# Altium project Controller_TRK_hv2.PrjPcb
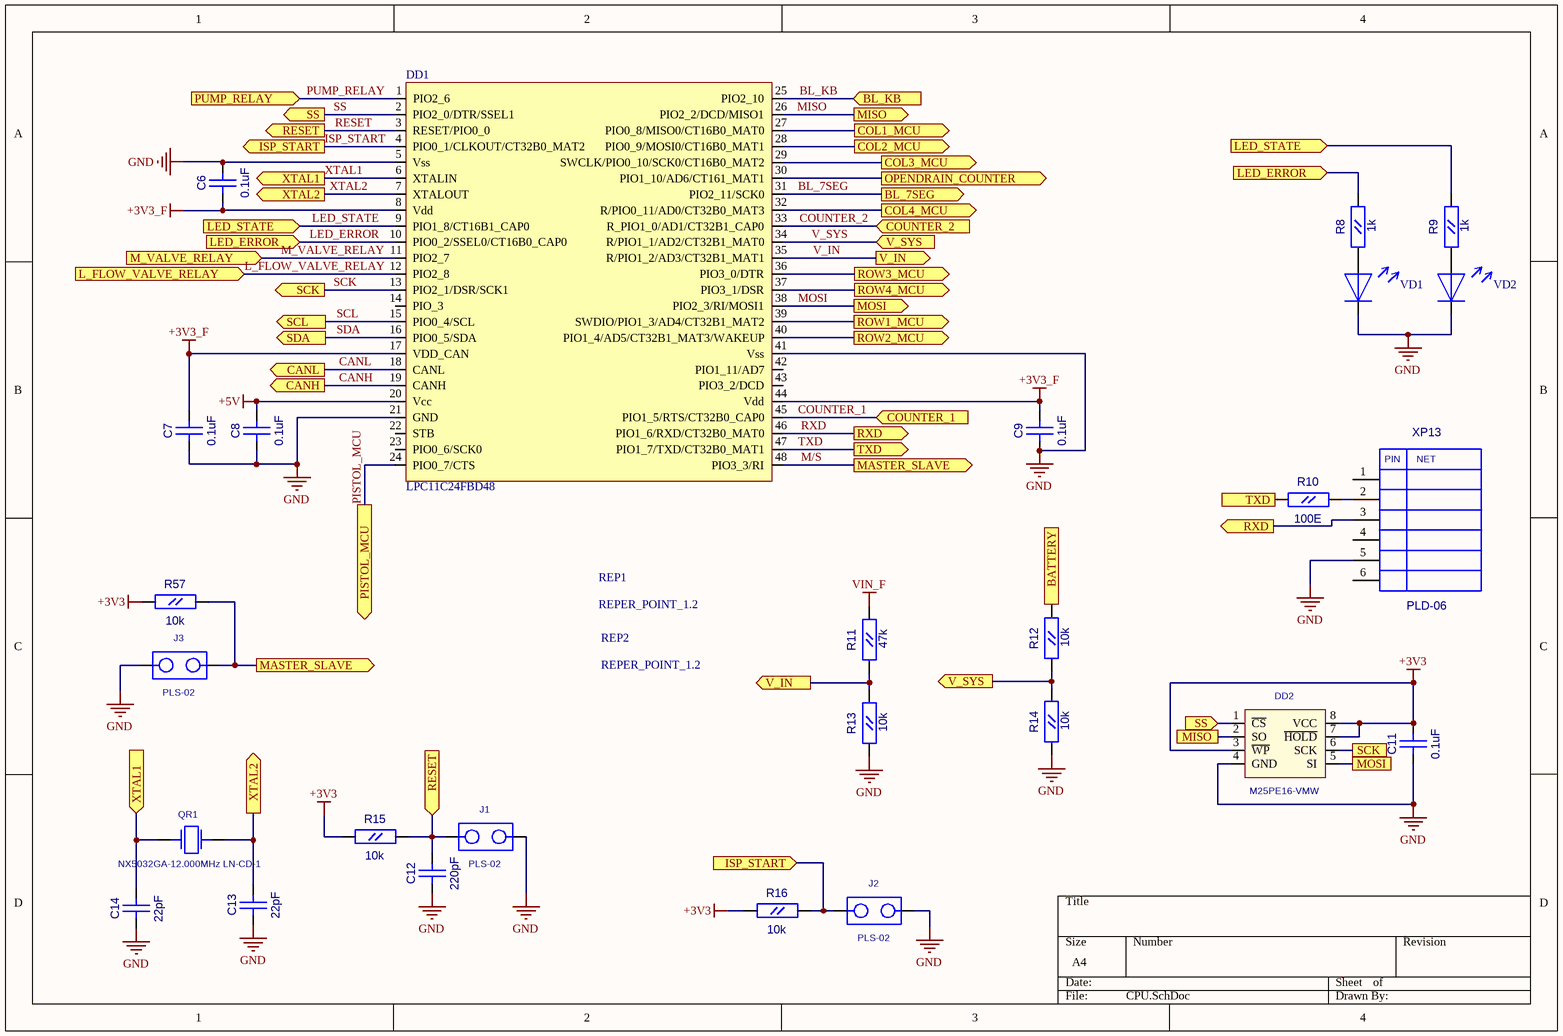
[diagram p0: CPU.SchDoc]
8 sheets, 179 parts. Net scope: flat (ports and power ports of the same name join across sheets).
Board file: Controller_TRK_hv2.PcbDoc
Sheets:
  CPU.SchDoc
  Keyboard.SchDoc
  Connections.SchDoc
  Relay.SchDoc
  Input.SchDoc
  Output.SchDoc
  Battery.SchDoc
  Power.SchDoc

## Sheet CPU.SchDoc
size A4

### Parts
C6  0.1uF  [CC0603]
C7  0.1uF  [CC0603]
C8  0.1uF  [CC0603]
C9  0.1uF  [CC0603]
C11  0.1uF  [CC0603]
C12  220pF  [CC0603]
C13  22pF  [CC0603]
C14  22pF  [CC0603]
DD1  LPC11C24FBD48  [LQFP48]
DD2  M25PE16-VMW  [EIAJ_SO8]
J1  PLS-02  [PLS-02]
J2  PLS-02  [PLS-02]
J3  PLS-02  [PLS-02]
QR1  NX5032GA-12.000MHz LN-CD-1  [AC5032_2]
R8  1k  [RC0603]
R9  1k  [RC0603]
R10  100E  [RC0603]
R11  47k  [RC0603]
R12  10k  [RC0603]
R13  10k  [RC0603]
R14  10k  [RC0603]
R15  10k  [RC0603]
R16  10k  [RC0603]
R57  10k  [RC0603]
REP1  REPER_POINT_1.2  [REPER1.2]
REP2  REPER_POINT_1.2  [REPER1.2]
VD1  LED_0805  [LED0805]  (value not drawn)
VD2  LED_0805  [LED0805]  (value not drawn)
XP13  PLD-06  [PIN6]

### Ports
BATTERY (in), BL_7SEG (out), BL_KB (in), CANH (out), CANL (out), COL1_MCU (out), COL2_MCU (out), COL3_MCU (out), COL4_MCU (out), COUNTER_1 (in), COUNTER_2 (in), ISP_START (in), ISP_START (out), L_FLOW_VALVE_RELAY (in), LED_ERROR (in), LED_STATE (in), M_VALVE_RELAY (in), MASTER_SLAVE (out), MISO, MISO (out), MOSI, MOSI (out), OPENDRAIN_COUNTER (out), PISTOL_MCU (out), PUMP_RELAY (in), RESET (in), RESET (out), ROW1_MCU (out), ROW2_MCU (out), ROW3_MCU (out), ROW4_MCU (out), RXD (out), SCK, SCK (out), SCL (out), SDA (out), SS (in), SS (out), TXD (in), TXD (out), V_IN (out), V_SYS (in), V_SYS (out), XTAL1 (in), XTAL1 (out), XTAL2 (out)

### Nets
+3V3: C11.2(B) DD2.3(~{WP}) DD2.7(~{HOLD}) DD2.8(VCC) R15.1(A) R16.1(A) R57.1(A)
+3V3_F: C6.1(A) C7.2(B) C9.2(B) DD1.8(Vdd) DD1.17(VDD_CAN) DD1.44(Vdd)
+5V: C8.2(B) DD1.20(Vcc)
GND: C6.2(B) C7.1(A) C8.1(A) C9.1(A) C11.1(A) C12.1(A) C13.1(A) C14.1(A) DD1.5(Vss) DD1.21(GND) DD1.41(Vss) DD2.4(GND) J1.2 J2.2 J3.1 R13.1(A) R14.1(A) VD1.2 VD2.2 XP13.5
VIN_F: R11.2(B)
BL_7SEG: DD1.31(PIO2_11/SCK0) ; port BL_7SEG
BL_KB: DD1.25(PIO2_10) ; port BL_KB
CANH: DD1.19(CANH) ; port CANH
CANL: DD1.18(CANL) ; port CANL
COUNTER_1: DD1.45(PIO1_5/RTS/CT32B0_CAP0) ; port COUNTER_1
COUNTER_2: DD1.33(R_PIO1_0/AD1/CT32B1_CAP0) ; port COUNTER_2
ISP_START: DD1.4(PIO0_1/CLKOUT/CT32B0_MAT2) J2.1 R16.2(B) ; port ISP_START
L_FLOW_VALVE_RELAY: DD1.12(PIO2_8) ; port L_FLOW_VALVE_RELAY
LED_ERROR: DD1.10(PIO0_2/SSEL0/CT16B0_CAP0) R8.2(B) ; port LED_ERROR
LED_STATE: DD1.9(PIO1_8/CT16B1_CAP0) R9.2(B) ; port LED_STATE
M/S: DD1.48(PIO3_3/RI) J3.2 R57.2(B) ; port MASTER_SLAVE
M_VALVE_RELAY: DD1.11(PIO2_7) ; port M_VALVE_RELAY
MISO: DD1.26(PIO2_2/DCD/MISO1) DD2.2(SO) ; port MISO
MOSI: DD1.38(PIO2_3/RI/MOSI1) DD2.5(SI) ; port MOSI
PISTOL_MCU: DD1.24(PIO0_7/CTS) ; port PISTOL_MCU
PUMP_RELAY: DD1.1(PIO2_6) ; port PUMP_RELAY
RESET: C12.2(B) DD1.3(RESET/PIO0_0) J1.1 R15.2(B) ; port RESET
RXD: DD1.46(PIO1_6/RXD/CT32B0_MAT0) XP13.3 ; port RXD
SCK: DD1.13(PIO2_1/DSR/SCK1) DD2.6(SCK) ; port SCK
SCL: DD1.15(PIO0_4/SCL) ; port SCL
SDA: DD1.16(PIO0_5/SDA) ; port SDA
SS: DD1.2(PIO2_0/DTR/SSEL1) DD2.1(~{CS}) ; port SS
TXD: DD1.47(PIO1_7/TXD/CT32B0_MAT1) R10.1(A) ; port TXD
V_IN: DD1.35(R/PIO1_2/AD3/CT32B1_MAT1) R11.1(A) R13.2(B) ; port V_IN
V_SYS: DD1.34(R/PIO1_1/AD2/CT32B1_MAT0) R12.1(A) R14.2(B) ; port V_SYS
XTAL1: C14.2(B) DD1.6(XTALIN) QR1.1 ; port XTAL1
XTAL2: C13.2(B) DD1.7(XTALOUT) QR1.2 ; port XTAL2
NetC4_2: R12.2(B) ; port BATTERY
NetDD1_27: DD1.27(PIO0_8/MISO0/CT16B0_MAT0) ; port COL1_MCU
NetDD1_28: DD1.28(PIO0_9/MOSI0/CT16B0_MAT1) ; port COL2_MCU
NetDD1_29: DD1.29(SWCLK/PIO0_10/SCK0/CT16B0_MAT2) ; port COL3_MCU
NetDD1_30: DD1.30(PIO1_10/AD6/CT161_MAT1) ; port OPENDRAIN_COUNTER
NetDD1_32: DD1.32(R/PIO0_11/AD0/CT32B0_MAT3) ; port COL4_MCU
NetDD1_36: DD1.36(PIO3_0/DTR) ; port ROW3_MCU
NetDD1_37: DD1.37(PIO3_1/DSR) ; port ROW4_MCU
NetDD1_39: DD1.39(SWDIO/PIO1_3/AD4/CT32B1_MAT2) ; port ROW1_MCU
NetDD1_40: DD1.40(PIO1_4/AD5/CT32B1_MAT3/WAKEUP) ; port ROW2_MCU
NetR8_1: R8.1(A) VD1.1
NetR9_1: R9.1(A) VD2.1
NetR10_2: R10.2(B) XP13.2

Not connected (* = marked no-connect by the designer): DD1 14(PIO_3) 22(STB) 23(PIO0_6/SCK0) 42(PIO1_11/AD7) 43(PIO3_2/DCD); REP1 1; REP2 1; XP13 1 4 6

### Notes on the sheet
- (in symbol PLD-06) PIN; NET

### Library data of the parts
C6-C9 C11-C14 = CC0603
  C6-C9 C11: Value: 0.1uF
  C12: Value: 220pF
  C13 C14: Value: 22pF
DD2 = S25FL016A0LMFI01: Value: M25PE16-VMW
QR1 = AC5032_2: AC5032/2; Value: NX5032GA-12.000MHz LN-CD-1
R8-R16 R57 = RC0603
  R8 R9: Value: 1k
  R10: Value: 100E
  R11: Value: 47k
  R12-R16 R57: Value: 10k
REP1 REP2 = REPER1.2: Value: REPER_POINT_1.2
XP13 = PLD-06: PLD06; Value: *
DD1 = LPC11C24FBD48: Value: LPC11C24FBD48
J1-J3 = PLS-02: Value: *
VD1 VD2 = LED_0805: Value: LED_0805

## Sheet Keyboard.SchDoc
size A4
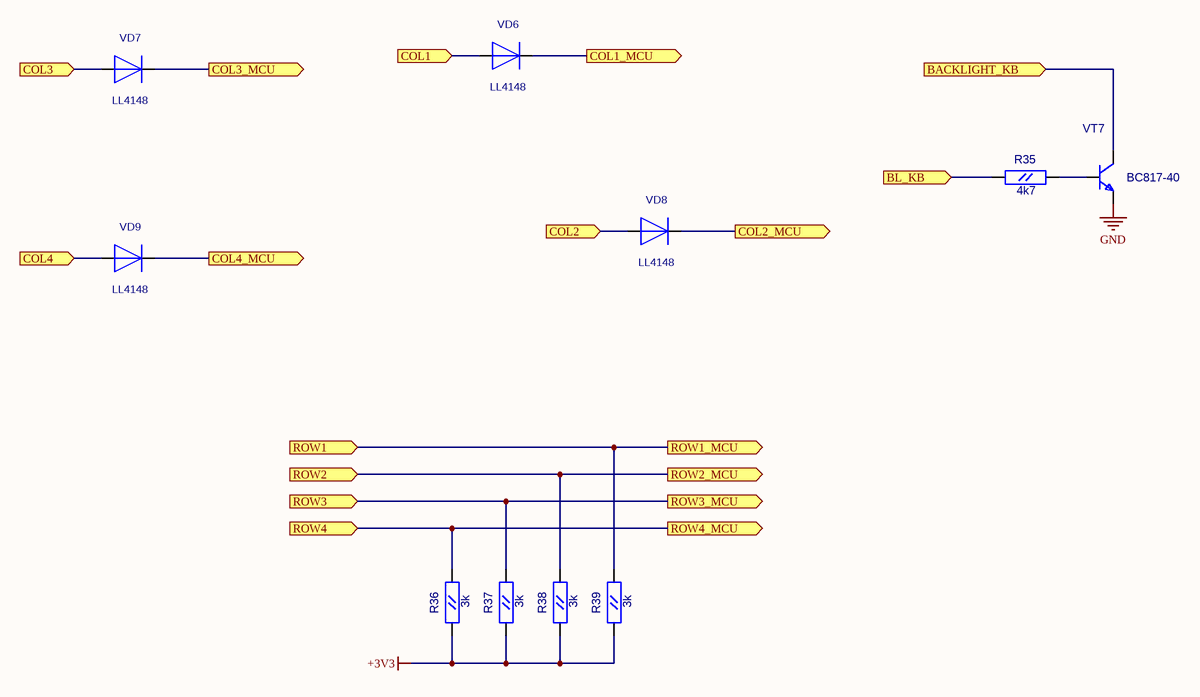
[diagram p1: Keyboard.SchDoc]

### Parts
R35  4k7  [RC0603]
R36  3k  [RC0603]
R37  3k  [RC0603]
R38  3k  [RC0603]
R39  3k  [RC0603]
VD6  LL4148  [SOD-80]
VD7  LL4148  [SOD-80]
VD8  LL4148  [SOD-80]
VD9  LL4148  [SOD-80]
VT7  BC817-40  [SOT-23(123)]

### Ports
BACKLIGHT_KB (in), BL_KB (in), COL1 (in), COL1_MCU (out), COL2 (in), COL2_MCU (out), COL3 (in), COL3_MCU (out), COL4 (in), COL4_MCU (out), ROW1 (in), ROW1_MCU (out), ROW2 (in), ROW2_MCU (out), ROW3 (in), ROW3_MCU (out), ROW4 (in), ROW4_MCU (out)

### Nets
+3V3: R36.1(A) R37.1(A) R38.1(A) R39.1(A)
GND: VT7.2(E)
BL_KB: R35.1(A) ; port BL_KB
NetDD1_27: VD6.2(+) ; port COL1_MCU
NetDD1_28: VD8.2(+) ; port COL2_MCU
NetDD1_29: VD7.2(+) ; port COL3_MCU
NetDD1_32: VD9.2(+) ; port COL4_MCU
NetDD1_36: R37.2(B) ; port ROW3_MCU, port ROW3
NetDD1_37: R36.2(B) ; port ROW4_MCU, port ROW4
NetDD1_39: R39.2(B) ; port ROW1_MCU, port ROW1
NetDD1_40: R38.2(B) ; port ROW2_MCU, port ROW2
NetR35_2: R35.2(B) VT7.1(B)
NetVD6_1: VD6.1(-) ; port COL1
NetVD7_1: VD7.1(-) ; port COL3
NetVD8_1: VD8.1(-) ; port COL2
NetVD9_1: VD9.1(-) ; port COL4
NetVT7_3: VT7.3(C) ; port BACKLIGHT_KB

### Library data of the parts
R35-R39 = RC0603
  R35: Value: 4k7
  R36-R39: Value: 3k
VT7 = BC846BLT1: NPN 500ma transistor; ComponentField7: Published 29-Sep-2000; OriginalName: BC846BLT1; Value: BC817-40
VD6-VD9 = LL4148: Value: *

## Sheet Connections.SchDoc
size A4
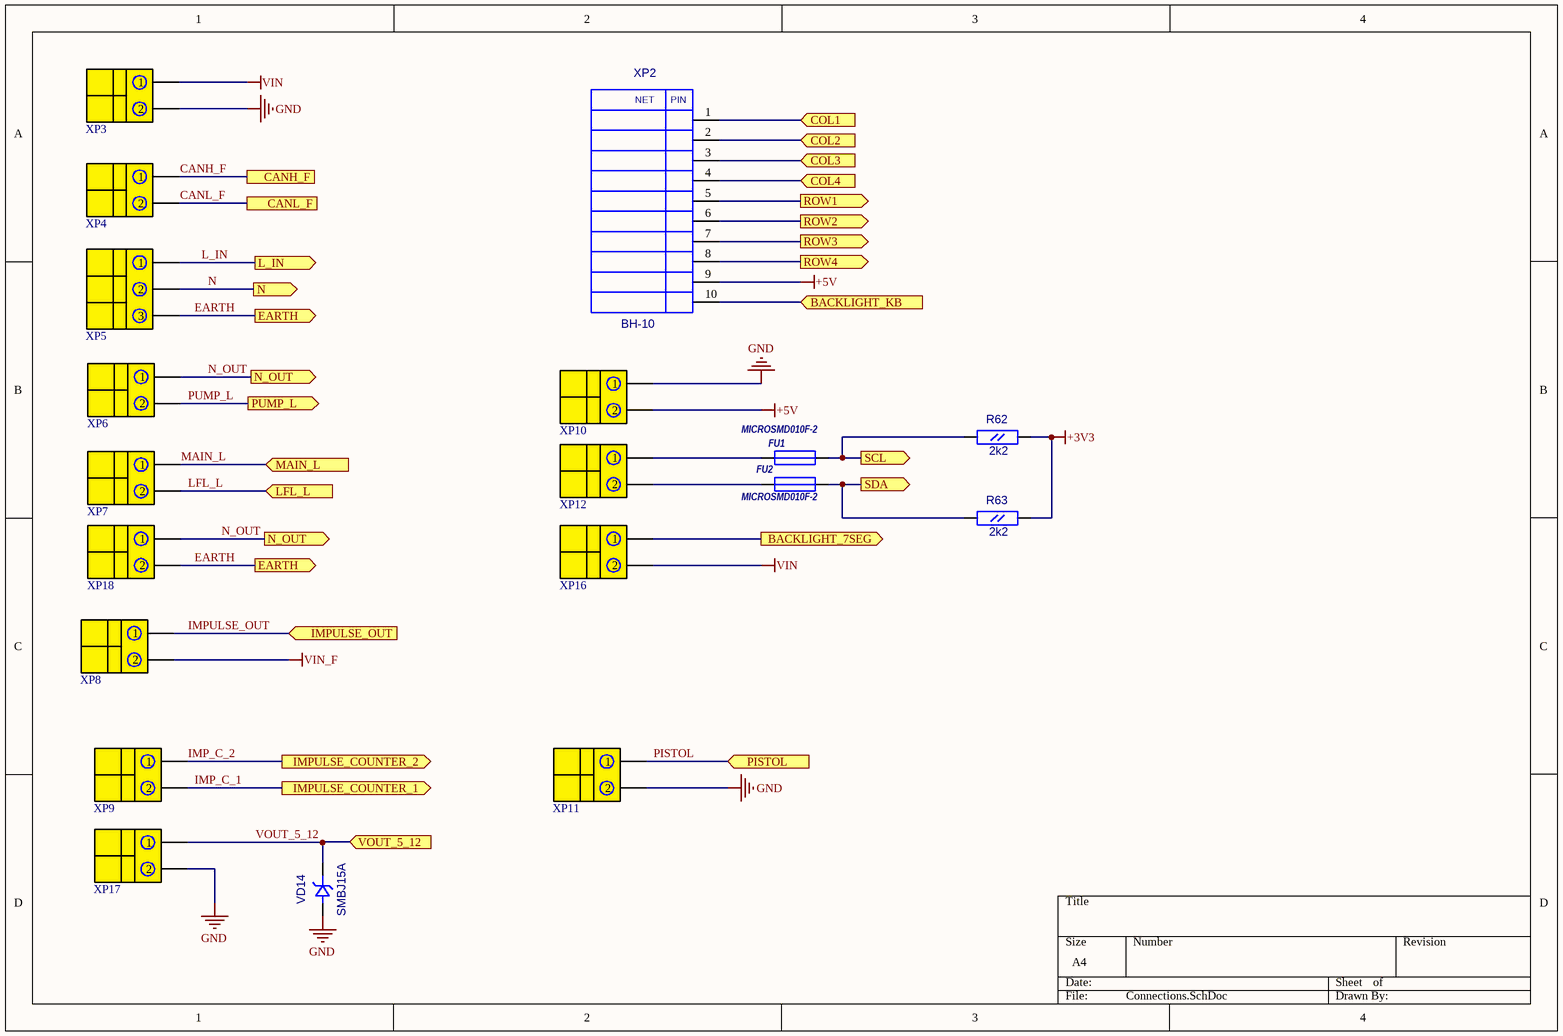
[diagram p2: Connections.SchDoc]

### Parts
FU1  MICROSMD010F-2  [RC1210]
FU2  MICROSMD010F-2  [RC1210]
R62  2k2  [RC0603]
R63  2k2  [RC0603]
VD14  SMBJ15A  [SMB]
XP2  BH-10  [BH-10]
XP3  DG330-2PIN  [DG330-2PIN]  (value not drawn)
XP4  DG330-2PIN  [DG330-2PIN]  (value not drawn)
XP5  DG330-3PIN  [DG330-3PIN]  (value not drawn)
XP6  DG330-2PIN  [DG330-2PIN]  (value not drawn)
XP7  DG330-2PIN  [DG330-2PIN]  (value not drawn)
XP8  DG330-2PIN  [DG330-2PIN]  (value not drawn)
XP9  DG330-2PIN  [DG330-2PIN]  (value not drawn)
XP10  DG330-2PIN  [DG330-2PIN]  (value not drawn)
XP11  DG330-2PIN  [DG330-2PIN]  (value not drawn)
XP12  DG330-2PIN  [DG330-2PIN]  (value not drawn)
XP16  DG330-2PIN  [DG330-2PIN]  (value not drawn)
XP17  DG330-2PIN  [DG330-2PIN]  (value not drawn)
XP18  DG330-2PIN  [DG330-2PIN]  (value not drawn)

### Ports
BACKLIGHT_7SEG (out), BACKLIGHT_KB (in), CANH_F, CANL_F, COL1 (in), COL2 (in), COL3 (in), COL4 (in), EARTH (out), IMPULSE_COUNTER_1 (out), IMPULSE_COUNTER_2 (out), IMPULSE_OUT (in), L_IN (out), LFL_L (in), MAIN_L (in), N (out), N_OUT (out), PISTOL (in), PUMP_L (out), ROW1 (out), ROW2 (out), ROW3 (out), ROW4 (out), SCL (out), SDA (out), VOUT_5_12 (in)

### Nets
+3V3: R62.2(B) R63.2(B)
+5V: XP2.9 XP10.2
GND: VD14.1(A) XP3.2 XP10.1 XP11.2 XP17.2
VIN: XP3.1 XP16.2
VIN_F: XP8.2
CANH_F: XP4.1 ; port CANH_F
CANL_F: XP4.2 ; port CANL_F
EARTH: XP5.3 XP18.2 ; port EARTH
IMP_C_1: XP9.2 ; port IMPULSE_COUNTER_1
IMP_C_2: XP9.1 ; port IMPULSE_COUNTER_2
IMPULSE_OUT: XP8.1 ; port IMPULSE_OUT
L_IN: XP5.1 ; port L_IN
LFL_L: XP7.2 ; port LFL_L
MAIN_L: XP7.1 ; port MAIN_L
N: XP5.2 ; port N
N_OUT: XP6.1 XP18.1 ; port N_OUT
PISTOL: XP11.1 ; port PISTOL
PUMP_L: XP6.2 ; port PUMP_L
SCL: FU1.2 R62.1(A) ; port SCL
SDA: FU2.2 R63.1(A) ; port SDA
VOUT_5_12: VD14.2(K) XP17.1 ; port VOUT_5_12
NetDD1_36: XP2.7 ; port ROW3
NetDD1_37: XP2.8 ; port ROW4
NetDD1_39: XP2.5 ; port ROW1
NetDD1_40: XP2.6 ; port ROW2
NetFU1_1: FU1.1 XP12.1
NetFU2_1: FU2.1 XP12.2
NetFU7_2: XP16.1 ; port BACKLIGHT_7SEG
NetVD6_1: XP2.1 ; port COL1
NetVD7_1: XP2.3 ; port COL3
NetVD8_1: XP2.2 ; port COL2
NetVD9_1: XP2.4 ; port COL4
NetVT7_3: XP2.10 ; port BACKLIGHT_KB

### Notes on the sheet
- (in symbol BH-10) NET; PIN

### Library data of the parts
FU1 FU2 = MICROSMD: Value: MICROSMD010F-2
R62 R63 = RC0603: Value: 2k2
VD14 = SMBJ: Value: SMBJ15A
XP2 = BH-10: Value: *
XP3 XP4 XP6-XP12 XP16-XP18 = DG330-2PIN: Value: DG330-2PIN
XP5 = DG330-3PIN: Value: DG330-3PIN

## Sheet Relay.SchDoc
size A4
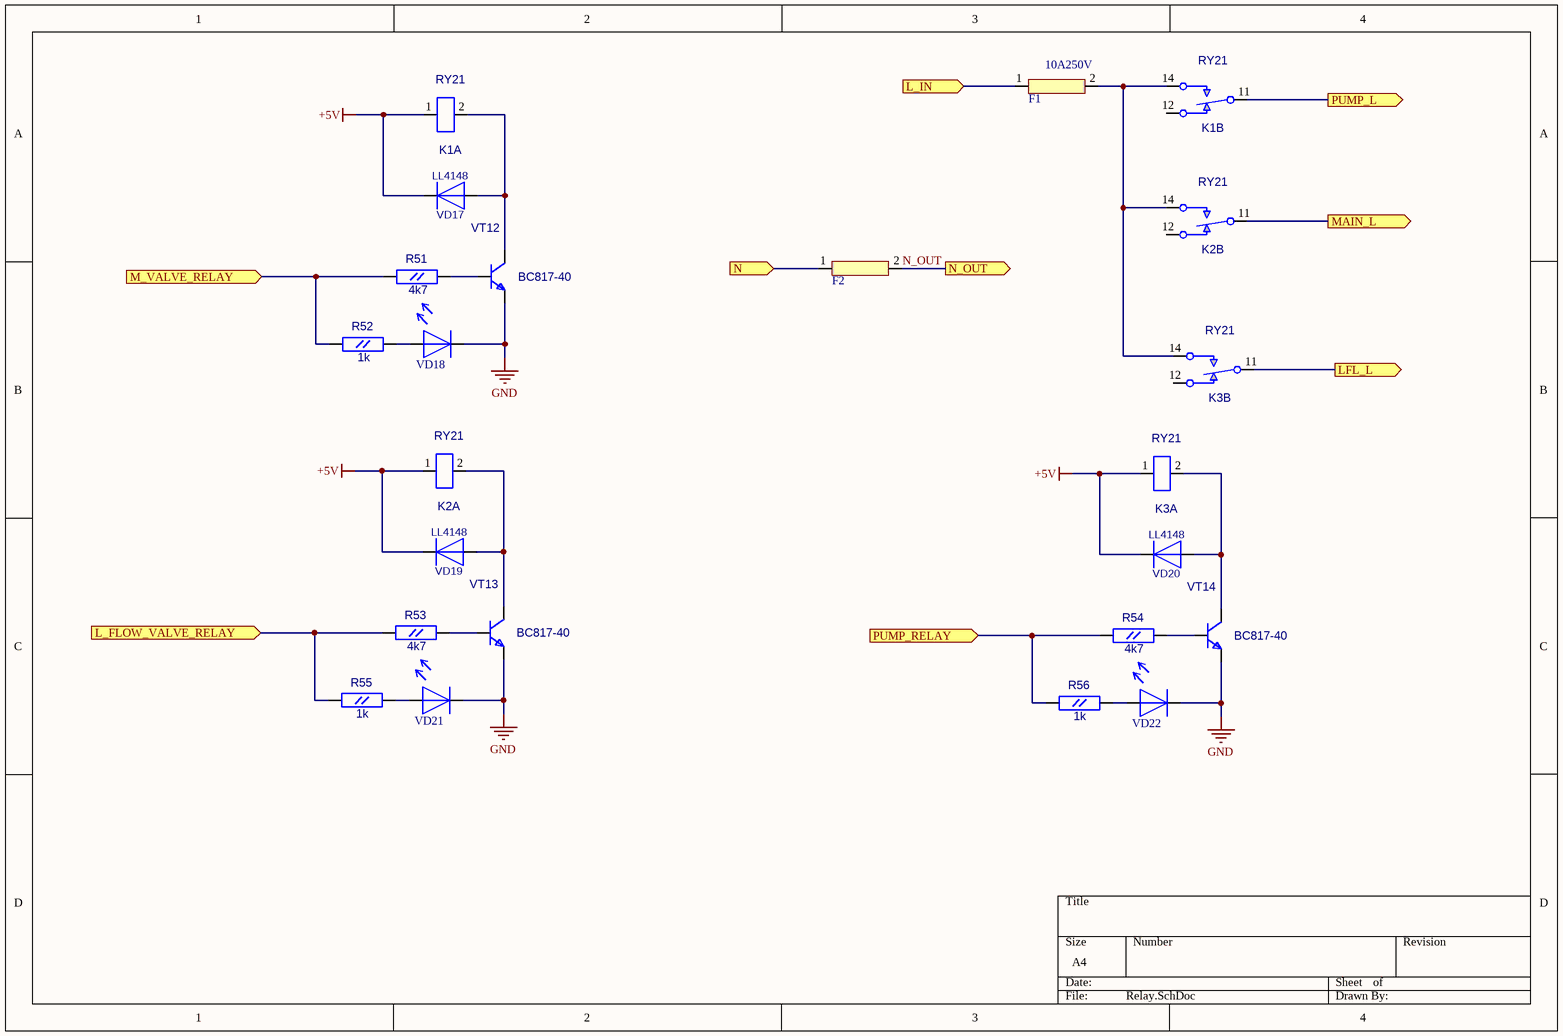
[diagram p3: Relay.SchDoc]

### Parts
F1  KLS5-266(5x20) 2pcs  [Fuse_5x20]  (value not drawn)
F2  KLS5-266(5x20) 2pcs  [Fuse_5x20]  (value not drawn)
K1  RY21  [RY21_RY21(Primary)]  (parts A,B of 2)
K2  RY21  [RY21_RY21(Primary)]  (parts A,B of 2)
K3  RY21  [RY21_RY21(Primary)]  (parts A,B of 2)
R51  4k7  [RC0603]
R52  1k  [RC0603]
R53  4k7  [RC0603]
R54  4k7  [RC0603]
R55  1k  [RC0603]
R56  1k  [RC0603]
VD17  LL4148  [SOD-80]
VD18  LED_0805  [LED0805]  (value not drawn)
VD19  LL4148  [SOD-80]
VD20  LL4148  [SOD-80]
VD21  LED_0805  [LED0805]  (value not drawn)
VD22  LED_0805  [LED0805]  (value not drawn)
VT12  BC817-40  [SOT-23(123)]
VT13  BC817-40  [SOT-23(123)]
VT14  BC817-40  [SOT-23(123)]

### Ports
L_FLOW_VALVE_RELAY (in), L_IN (in), LFL_L (out), M_VALVE_RELAY (in), MAIN_L (out), N (in), N_OUT (out), PUMP_L (out), PUMP_RELAY (in)

### Nets
+5V: K1.1(L1) K2.1(L1) K3.1(L1) VD17.2(+) VD19.2(+) VD20.2(+)
GND: VD18.2 VD21.2 VD22.2 VT12.2(E) VT13.2(E) VT14.2(E)
L_FLOW_VALVE_RELAY: R53.1(A) R55.1(A) ; port L_FLOW_VALVE_RELAY
L_IN: F1.1 ; port L_IN
LFL_L: K3.11(C1) ; port LFL_L
M_VALVE_RELAY: R51.1(A) R52.1(A) ; port M_VALVE_RELAY
MAIN_L: K2.11(C1) ; port MAIN_L
N: F2.1 ; port N
N_OUT: F2.2 ; port N_OUT
PUMP_L: K1.11(C1) ; port PUMP_L
PUMP_RELAY: R54.1(A) R56.1(A) ; port PUMP_RELAY
NetF1_2: F1.2 K1.14(C2) K2.14(C2) K3.14(C2)
NetK1_2: K1.2(C2) VD17.1(-) VT12.3(C)
NetK2_2: K2.2(C2) VD19.1(-) VT13.3(C)
NetK3_2: K3.2(C2) VD20.1(-) VT14.3(C)
NetR51_2: R51.2(B) VT12.1(B)
NetR52_2: R52.2(B) VD18.1
NetR53_2: R53.2(B) VT13.1(B)
NetR54_2: R54.2(B) VT14.1(B)
NetR55_2: R55.2(B) VD21.1
NetR56_2: R56.2(B) VD22.1

Not connected (* = marked no-connect by the designer): K1 12(C3); K2 12(C3); K3 12(C3)

### Notes on the sheet
- (near F1) 10A250V

### Library data of the parts
F1 F2 = Fuse KLS5-266(5x20): Value: KLS5-266(5x20) 2pcs
R51-R56 = RC0603
  R51 R53 R54: Value: 4k7
  R52 R55 R56: Value: 1k
VT12-VT14 = BC846BLT1: as VT7 on sheet Keyboard; OriginalName: BC846BLT1; Value: BC817-40
K1-K3 = RY21: Value: *
VD17 VD19 VD20 = LL4148: Value: *
VD18 VD21 VD22 = LED_0805: Value: LED_0805

## Sheet Input.SchDoc
size A4
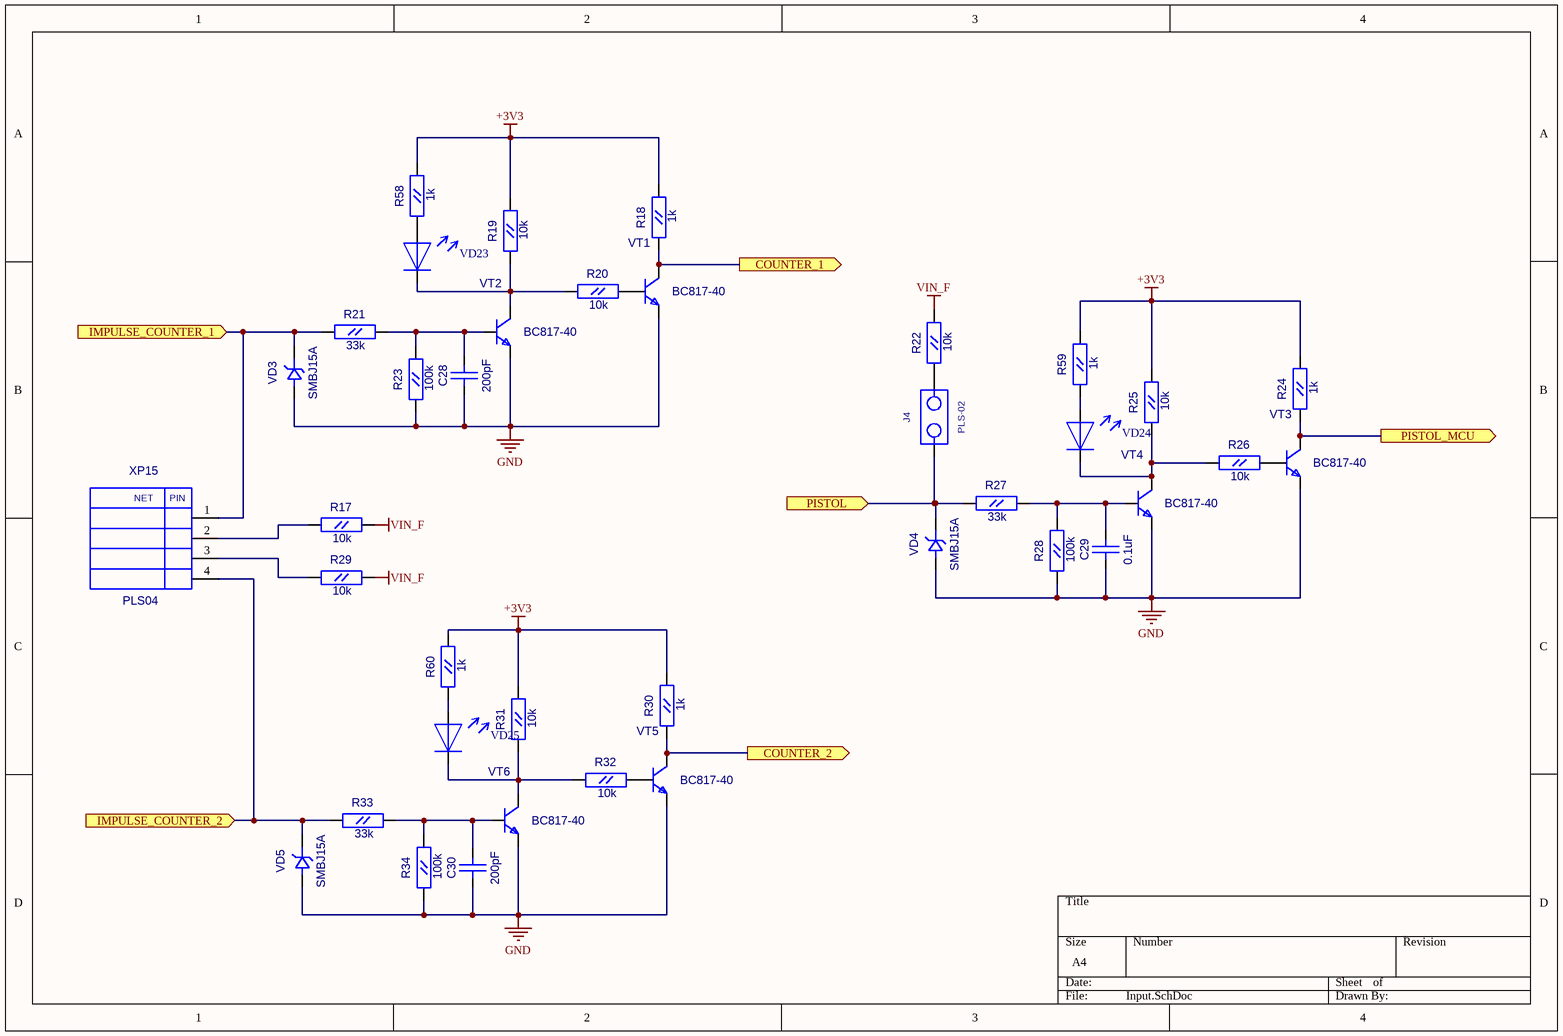
[diagram p4: Input.SchDoc]

### Parts
C28  200pF  [CC0603]
C29  0.1uF  [CC0603]
C30  200pF  [CC0603]
J4  PLS-02  [PLS-02]
R17  10k  [RC0603]
R18  1k  [RC0603]
R19  10k  [RC0603]
R20  10k  [RC0603]
R21  33k  [RC0603]
R22  10k  [RC0603]
R23  100k  [RC0603]
R24  1k  [RC0603]
R25  10k  [RC0603]
R26  10k  [RC0603]
R27  33k  [RC0603]
R28  100k  [RC0603]
R29  10k  [RC0603]
R30  1k  [RC0603]
R31  10k  [RC0603]
R32  10k  [RC0603]
R33  33k  [RC0603]
R34  100k  [RC0603]
R58  1k  [RC0603]
R59  1k  [RC0603]
R60  1k  [RC0603]
VD3  SMBJ15A  [SMB]
VD4  SMBJ15A  [SMB]
VD5  SMBJ15A  [SMB]
VD23  LED_0805  [LED0805]  (value not drawn)
VD24  LED_0805  [LED0805]  (value not drawn)
VD25  LED_0805  [LED0805]  (value not drawn)
VT1  BC817-40  [SOT-23(123)]
VT2  BC817-40  [SOT-23(123)]
VT3  BC817-40  [SOT-23(123)]
VT4  BC817-40  [SOT-23(123)]
VT5  BC817-40  [SOT-23(123)]
VT6  BC817-40  [SOT-23(123)]
XP15  PLS04  [PIN04S]

### Ports
COUNTER_1 (out), COUNTER_2 (out), IMPULSE_COUNTER_1 (in), IMPULSE_COUNTER_2 (in), PISTOL (in), PISTOL_MCU (out)

### Nets
+3V3: R18.2(B) R19.2(B) R24.2(B) R25.2(B) R30.2(B) R31.2(B) R58.2(B) R59.2(B) R60.2(B)
GND: C28.1(A) C29.1(A) C30.1(A) R23.1(A) R28.1(A) R34.1(A) VD3.1(A) VD4.1(A) VD5.1(A) VT1.2(E) VT2.2(E) VT3.2(E) VT4.2(E) VT5.2(E) VT6.2(E)
VIN_F: R17.2(B) R22.2(B) R29.2(B)
COUNTER_1: R18.1(A) VT1.3(C) ; port COUNTER_1
COUNTER_2: R30.1(A) VT5.3(C) ; port COUNTER_2
IMP_C_1: R21.1(A) VD3.2(K) XP15.1 ; port IMPULSE_COUNTER_1
IMP_C_2: R33.1(A) VD5.2(K) XP15.4 ; port IMPULSE_COUNTER_2
PISTOL: J4.1 R27.1(A) VD4.2(K) ; port PISTOL
PISTOL_MCU: R24.1(A) VT3.3(C) ; port PISTOL_MCU
NetC28_2: C28.2(B) R21.2(B) R23.2(B) VT2.1(B)
NetC29_2: C29.2(B) R27.2(B) R28.2(B) VT4.1(B)
NetC30_2: C30.2(B) R33.2(B) R34.2(B) VT6.1(B)
NetJ4_2: J4.2 R22.1(A)
NetR17_1: R17.1(A) XP15.2
NetR19_1: R19.1(A) R20.1(A) VD23.2 VT2.3(C)
NetR20_2: R20.2(B) VT1.1(B)
NetR25_1: R25.1(A) R26.1(A) VD24.2 VT4.3(C)
NetR26_2: R26.2(B) VT3.1(B)
NetR29_1: R29.1(A) XP15.3
NetR31_1: R31.1(A) R32.1(A) VD25.2 VT6.3(C)
NetR32_2: R32.2(B) VT5.1(B)
NetR58_1: R58.1(A) VD23.1
NetR59_1: R59.1(A) VD24.1
NetR60_1: R60.1(A) VD25.1

### Notes on the sheet
- (in symbol PLS04) NET; PIN

### Library data of the parts
C28-C30 = CC0603
  C28 C30: Value: 200pF
  C29: Value: 0.1uF
R17-R34 R58-R60 = RC0603
  R17 R19 R20 R22 R25 R26 R29 R31 R32: Value: 10k
  R18 R24 R30 R58-R60: Value: 1k
  R21 R27 R33: Value: 33k
  R23 R28 R34: Value: 100k
VD3-VD5 = SMBJ: Value: SMBJ15A
VT1-VT6 = BC846BLT1: as VT7 on sheet Keyboard; OriginalName: BC846BLT1; Value: BC817-40
J4 = PLS-02: Value: *
VD23-VD25 = LED_0805: Value: LED_0805
XP15 = PLS04: Value: *

## Sheet Output.SchDoc
size A4
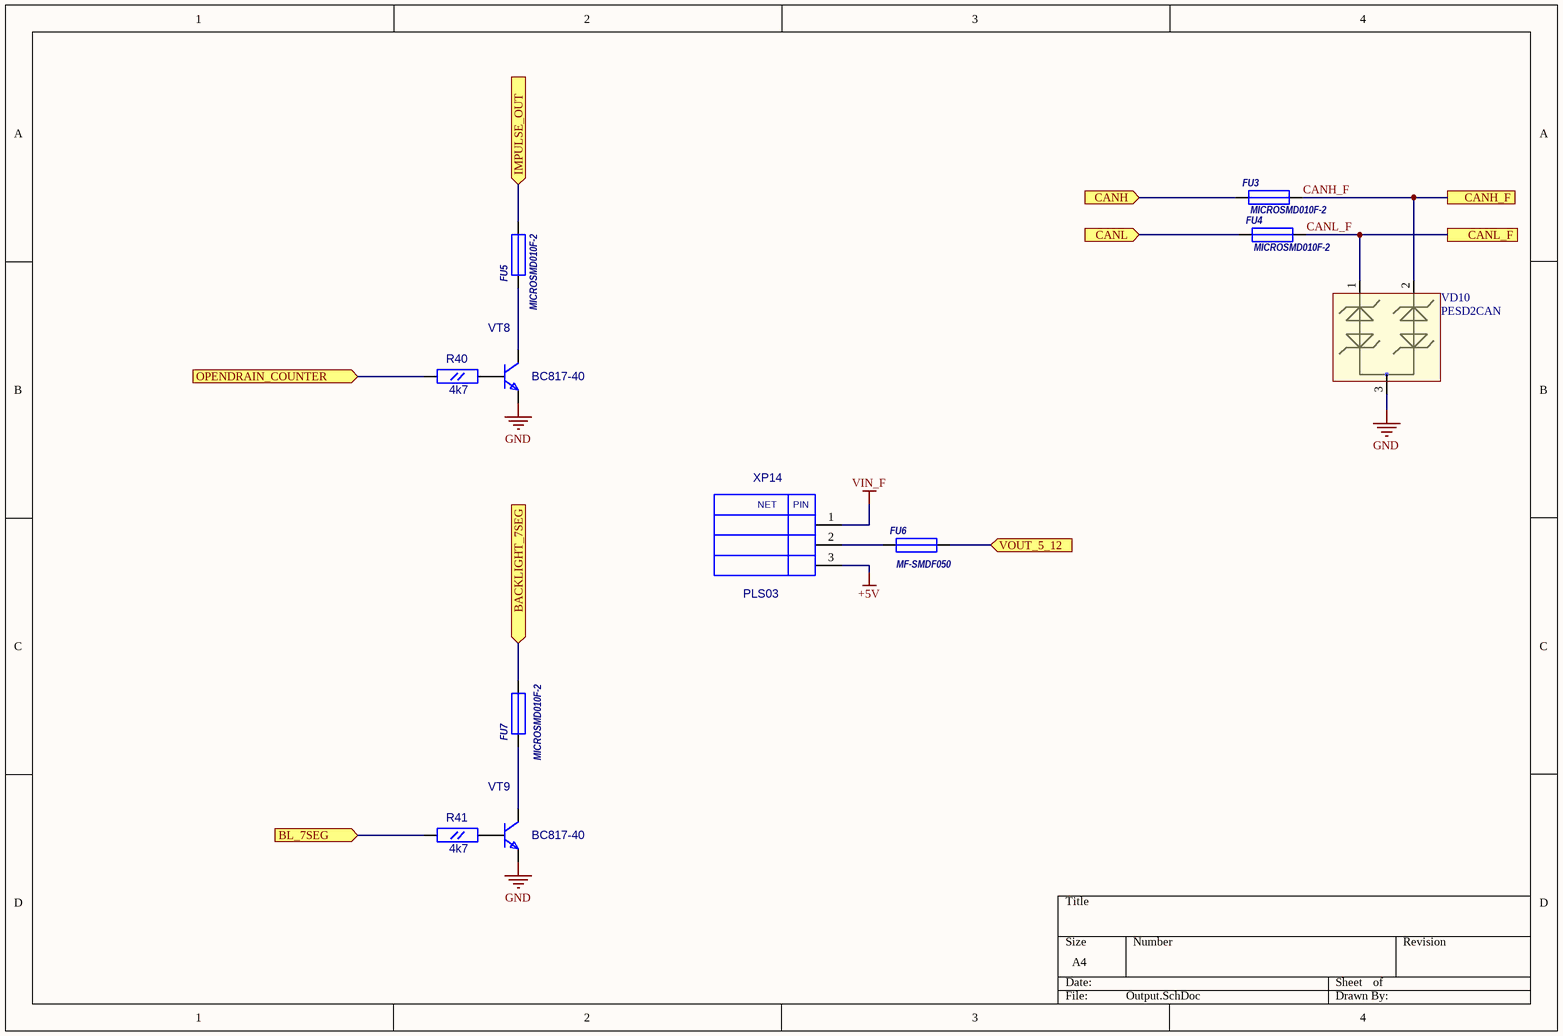
[diagram p5: Output.SchDoc]

### Parts
FU3  MICROSMD010F-2  [RC1210]
FU4  MICROSMD010F-2  [RC1210]
FU5  MICROSMD010F-2  [RC1210]
FU6  MF-SMDF050  [MF-SMDF]
FU7  MICROSMD010F-2  [RC1210]
R40  4k7  [RC0603]
R41  4k7  [RC0603]
VD10  PESD2CAN  [SOT-23(123)]
VT8  BC817-40  [SOT-23(123)]
VT9  BC817-40  [SOT-23(123)]
XP14  PLS03  [PLS-03]

### Ports
BACKLIGHT_7SEG (in), BL_7SEG (in), CANH (in), CANH_F, CANL (in), CANL_F, IMPULSE_OUT (in), OPENDRAIN_COUNTER (in), VOUT_5_12 (in)

### Nets
+5V: XP14.3
GND: VD10.3 VT8.2(E) VT9.2(E)
VIN_F: XP14.1
BL_7SEG: R41.1(A) ; port BL_7SEG
CANH: FU3.1 ; port CANH
CANH_F: FU3.2 VD10.2 ; port CANH_F
CANL: FU4.1 ; port CANL
CANL_F: FU4.2 VD10.1 ; port CANL_F
IMPULSE_OUT: FU5.2 ; port IMPULSE_OUT
VOUT_5_12: FU6.2 ; port VOUT_5_12
NetDD1_30: R40.1(A) ; port OPENDRAIN_COUNTER
NetFU5_1: FU5.1 VT8.3(C)
NetFU6_1: FU6.1 XP14.2
NetFU7_1: FU7.1 VT9.3(C)
NetFU7_2: FU7.2 ; port BACKLIGHT_7SEG
NetR40_2: R40.2(B) VT8.1(B)
NetR41_2: R41.2(B) VT9.1(B)

### Notes on the sheet
- (in symbol PLS03) NET; PIN

### Library data of the parts
FU3-FU5 FU7 = MICROSMD
  FU3 FU4: Value: MICROSMD010F-2
  FU5 FU7: Value: *
FU6 = MF-SMDF: Value: MF-SMDF050
R40 R41 = RC0603: Value: 4k7
VD10 = PESD2CAN: TVS for CAN
VT8 VT9 = BC846BLT1: as VT7 on sheet Keyboard; OriginalName: BC846BLT1; Value: BC817-40
XP14 = PLS03: Value: *

## Sheet Battery.SchDoc
size A4
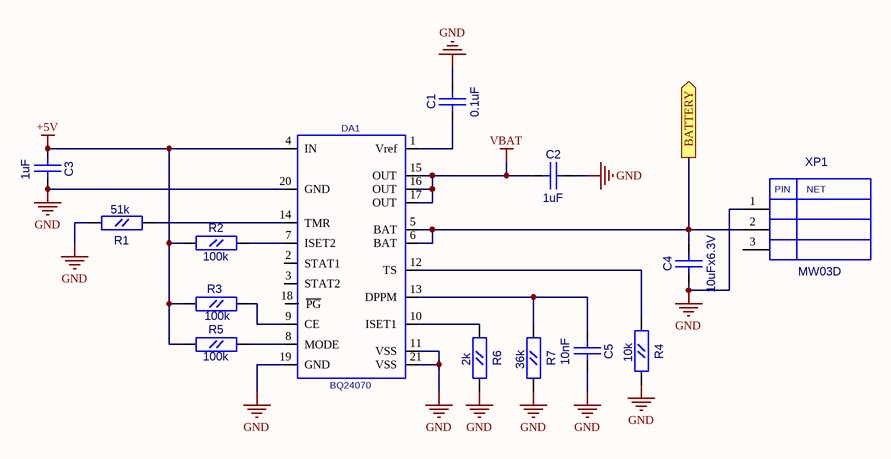
[diagram p6: Battery.SchDoc]

### Parts
C1  0.1uF  [CC0603]
C2  1uF  [CC0603]
C3  1uF  [CC0603]
C4  10uFx6.3V  [CC0805]
C5  10nF  [CC0603]
DA1  BQ24070  [P-PQFP-N20]
R1  51k  [RC0603]
R2  100k  [RC0603]
R3  100k  [RC0603]
R4  10k  [RC0603]
R5  100k  [RC0603]
R6  2k  [RC0603]
R7  36k  [RC0603]
XP1  MW03D  [MW03D]

### Ports
BATTERY (out)

### Nets
+5V: C3.1(A) DA1.4(IN) R2.2(B) R3.2(B) R5.2(B)
GND: C1.2(B) C2.2(B) C3.2(B) C4.1(A) C5.2(B) DA1.11(VSS) DA1.19(GND) DA1.20(GND) DA1.21(VSS) R1.2(B) R4.2(B) R6.2(B) R7.2(B) XP1.1
VBAT: C2.1(A) DA1.15(OUT) DA1.16(OUT) DA1.17(OUT)
NetC1_1: C1.1(A) DA1.1(Vref)
NetC4_2: C4.2(B) DA1.5(BAT) DA1.6(BAT) XP1.2 ; port BATTERY
NetC5_1: C5.1(A) DA1.13(DPPM) R7.1(A)
NetDA1_7: DA1.7(ISET2) R2.1(A)
NetDA1_8: DA1.8(MODE) R5.1(A)
NetDA1_9: DA1.9(CE) R3.1(A)
NetDA1_10: DA1.10(ISET1) R6.1(A)
NetDA1_12: DA1.12(TS) R4.1(A)
NetDA1_14: DA1.14(TMR) R1.1(A)

Not connected (* = marked no-connect by the designer): DA1 2(STAT1) 3(STAT2) 18(~{PG}); XP1 3

### Notes on the sheet
- (in symbol MW03D) PIN; NET

### Library data of the parts
C1-C3 C5 = CC0603
  C1: Value: 0.1uF
  C2 C3: Value: 1uF
  C5: Value: 10nF
C4 = CC0805: Value: 10uFx6.3V
R1-R7 = RC0603
  R1: Value: 51k
  R2 R3 R5: Value: 100k
  R4: Value: 10k
  R6: Value: 2k
  R7: Value: 36k
DA1 = BQ24070: Value: *
XP1 = MW03D: Value: *

## Sheet Power.SchDoc
size A4
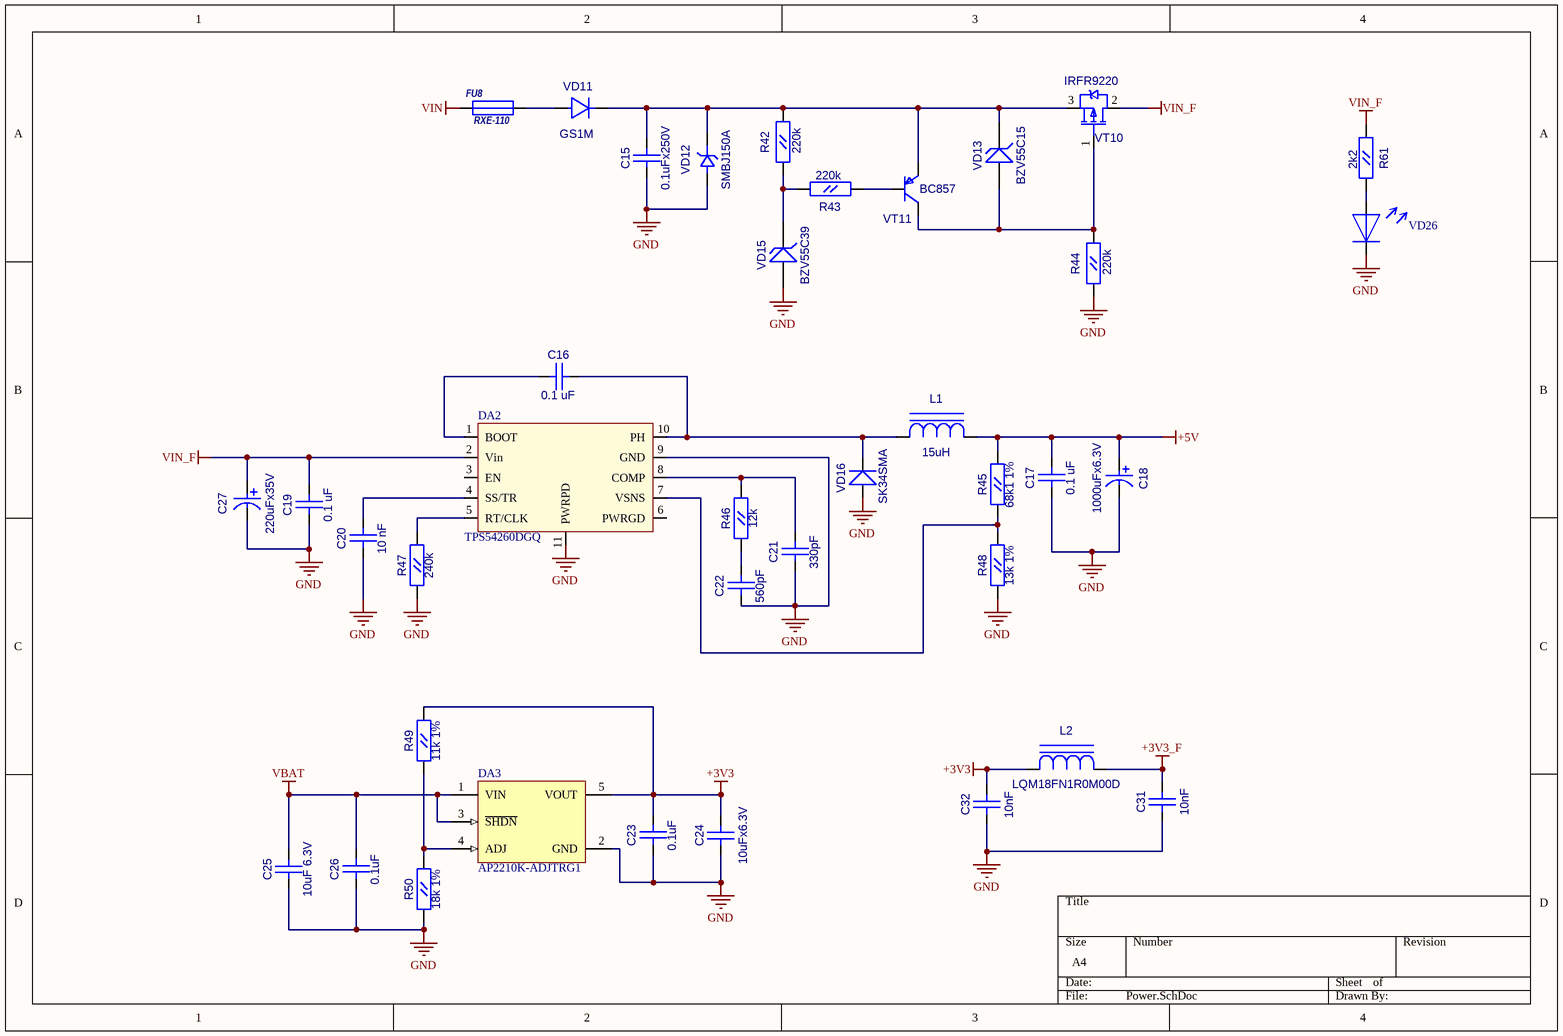
[diagram p7: Power.SchDoc]

### Parts
C15  0.1uFx250V  [CC1206]
C16  0.1 uF  [CC0603]
C17  0.1 uF  [CC0603]
C18  1000uFx6.3V  [CC8X3.5]
C19  0.1 uF  [CC0603]
C20  10 nF  [CC0603]
C21  330pF  [CC0603]
C22  560pF  [CC0603]
C23  0.1uF  [CC0603]
C24  10uFx6.3V  [CC0805]
C25  10uF 6.3V  [CC0805]
C26  0.1uF  [CC0603]
C27  220uFx35V  [CC16X10_CAP0.5(1)(Primary)]
C31  10nF  [CC0603]
C32  10nF  [CC0603]
DA2  TPS54260DGQ  [S-PDSO-G10]
DA3  AP2210K-ADJTRG1  [SOT23-5]
FU8  RXE-110  [RXE-110]
L1  15uH  [SDR0805]
L2  value LQM18FN1R0M00D  [L0603]  (hidden comment: L0603)
R42  220k  [RC0603]
R43  220k  [RC0603]
R44  220k  [RC0603]
R45  68k1 1%  [RC0603]
R46  12k  [RC0603]
R47  240k  [RC0603]
R48  13k 1%  [RC0603]
R49  11k 1%  [RC0603]
R50  18k 1%  [RC0603]
R61  2k2  [RC0603]
VD11  GS1M  [SMA]
VD12  SMBJ150A  [SMB]
VD13  BZV55C15  [SOD-80]
VD15  BZV55C39  [SOD-80]
VD16  SK34SMA  [SMA]
VD26  LED_0805  [LED0805]  (value not drawn)
VT10  IRFR9220  [D-PAK(TO-252AA)]
VT11  BC857  [SOT-23(123)]

### Nets
+3V3: C23.1(A) C24.2(B) C32.2(B) DA3.5(VOUT) L2.1(A) R49.2(B)
+3V3_F: C31.2(B) L2.2(C)
+5V: C17.1(A) C18.1 L1.2(A) R45.2(B)
GND: C15.1(A) C17.2(B) C18.2 C19.2(B) C20.2(B) C21.2(B) C22.2(B) C23.2(B) C24.1(A) C25.1(A) C26.2(B) C27.1 C31.1(A) C32.1(A) DA2.9(GND) DA2.11(PWRPD) DA3.2(GND) R44.1(A) R47.1(A) R48.1(A) R50.1(A) VD12.1(A) VD15.1(A) VD16.1(A) VD26.2
VBAT: C25.2(B) C26.1(A) DA3.1(VIN) DA3.3(~{SHDN})
VIN: FU8.1
VIN_F: C19.1(A) C27.2 DA2.2(Vin) R61.1(A) VT10.2(D)
NetC15_2: C15.2(B) R42.2(B) VD11.2(K) VD12.2(K) VD13.2 VT10.3(S) VT11.2(E)
NetC16_1: C16.1(A) DA2.10(PH) L1.1(C) VD16.2(K)
NetC16_2: C16.2(B) DA2.1(BOOT)
NetC20_1: C20.1(A) DA2.4(SS/TR)
NetC21_1: C21.1(A) DA2.8(COMP) R46.2(B)
NetC22_1: C22.1(A) R46.1(A)
NetDA2_5: DA2.5(RT/CLK) R47.2(B)
NetDA2_7: DA2.7(VSNS) R45.1(A) R48.2(B)
NetDA3_4: DA3.4(ADJ) R49.1(A) R50.2(B)
NetFU8_2: FU8.2 VD11.1(A)
NetR42_1: R42.1(A) R43.2(B) VD15.2
NetR43_1: R43.1(A) VT11.1(B)
NetR44_2: R44.2(B) VD13.1(A) VT10.1(G) VT11.3(C)
NetR61_2: R61.2(B) VD26.1

Not connected (* = marked no-connect by the designer): DA2 3(EN) 6(PWRGD)

### Library data of the parts
C15 = CC1206: Value: 0.1uFx250V
C16 C17 C19-C23 C26 C31 C32 = CC0603
  C16 C17 C19: Value: 0.1 uF
  C20: Value: 10 nF
  C21: Value: 330pF
  C22: Value: 560pF
  C23 C26: Value: 0.1uF
  C31 C32: Value: 10nF
C18 = CAP0.35: Value: 1000uFx6.3V
C24 C25 = CC0805
  C24: Value: 10uFx6.3V
  C25: Value: 10uF 6.3V
C27 = CAP0.5(1): Value: 220uFx35V
DA3 = MCP1824T-ADJE/OT: 300 mA, Low Voltage, Low Quiescent Current LDO Regulator, 5-Pin SOT-223, Extended Temperature, Tape and Reel; Published: 29-Jan-2009; DatasheetVersion: revA, Aug-2007; PackageVersion: revAW, Oct-2008; PackageReference: SOT-223-DC5; Publisher: Altium Limited; PackageDescription: 5-Lead Plastic Small Outline Transistor (DC) [SOT-223]; ComponentLink1Description: Manufacturer Link; ComponentLink1URL: http://www.microchip.com; ComponentLink2Description: Datasheet; ComponentLink2URL: http://ww1.microchip.com/downloads/en/DeviceDoc/22070a.pdf; ComponentLink3Description: Packaging Specification; ComponentLink3URL: http://ww1.microchip.com/downloads/en/PackagingSpec/00049AW.pdf
L1 = SDR0805: Value: 15uH
R42-R50 R61 = RC0603
  R42-R44: Value: 220k
  R45: Value: 68k1 1%
  R46: Value: 12k
  R47: Value: 240k
  R48: Value: 13k 1%
  R49: Value: 11k 1%
  R50: Value: 18k 1%
  R61: Value: 2k2
VD11 = GS1M: Value: {Value}
VD12 = SMBJ: Value: SMBJ150A
VD13 = BZV55C12: Zener Voltage Regulator Diode; Value: BZV55C15
VD15 = BZV55C12: Zener Voltage Regulator Diode; OriginalName: BXV55C39; ComponentField6: Pin 2 is not connected and not drawn.; ComponentField7: Published 29-Sep-2000; Value: BZV55C39
VD16 = SK34SMA: Schottky Rectifier; Value: {Value}
VT10 = IRFR9220: HEXFET Power MOSFET; OriginalName: IRLML5103; ComponentField7: Published 8-Jun-2000; Value: IRFR9220
VT11 = BC857B: PNP 100ma transistor; OriginalName: BC846BLT1; ComponentField7: Published 29-Sep-2000; Value: BC857
FU8 = RXE-110: Value: *
VD26 = LED_0805: Value: LED_0805

## Nets that join several sheets
+3V3: CPU (7 pins), Keyboard (R36.1 R37.1 R38.1 R39.1), Connections (R62.2 R63.2), Input (9 pins), Power (6 pins)
+3V3_F: CPU (6 pins), Power (C31.2 L2.2)
+5V: CPU (C8.2 DD1.20), Connections (XP2.9 XP10.2), Relay (6 pins), Output (XP14.3), Battery (5 pins), Power (C17.1 C18.1 L1.2 R45.2)
GND: CPU (20 pins), Keyboard (VT7.2), Connections (5 pins), Relay (6 pins), Input (15 pins), Output (VD10.3 VT8.2 VT9.2), Battery (14 pins), Power (25 pins)
VBAT: Battery (C2.1 DA1.15 DA1.16 DA1.17), Power (C25.2 C26.1 DA3.1 DA3.3)
VIN: Connections (XP3.1 XP16.2), Power (FU8.1)
VIN_F: CPU (R11.2), Connections (XP8.2), Input (R17.2 R22.2 R29.2), Output (XP14.1), Power (5 pins)
BL_7SEG: CPU (DD1.31), Output (R41.1)
BL_KB: CPU (DD1.25), Keyboard (R35.1)
CANH: CPU (DD1.19), Output (FU3.1)
CANH_F: Connections (XP4.1), Output (FU3.2 VD10.2)
CANL: CPU (DD1.18), Output (FU4.1)
CANL_F: Connections (XP4.2), Output (FU4.2 VD10.1)
COUNTER_1: CPU (DD1.45), Input (R18.1 VT1.3)
COUNTER_2: CPU (DD1.33), Input (R30.1 VT5.3)
IMP_C_1: Connections (XP9.2), Input (R21.1 VD3.2 XP15.1)
IMP_C_2: Connections (XP9.1), Input (R33.1 VD5.2 XP15.4)
IMPULSE_OUT: Connections (XP8.1), Output (FU5.2)
L_FLOW_VALVE_RELAY: CPU (DD1.12), Relay (R53.1 R55.1)
L_IN: Connections (XP5.1), Relay (F1.1)
LFL_L: Connections (XP7.2), Relay (K3.11)
M_VALVE_RELAY: CPU (DD1.11), Relay (R51.1 R52.1)
MAIN_L: Connections (XP7.1), Relay (K2.11)
N: Connections (XP5.2), Relay (F2.1)
N_OUT: Connections (XP6.1 XP18.1), Relay (F2.2)
NetC4_2: CPU (R12.2), Battery (C4.2 DA1.5 DA1.6 XP1.2)
NetDD1_27: CPU (DD1.27), Keyboard (VD6.2)
NetDD1_28: CPU (DD1.28), Keyboard (VD8.2)
NetDD1_29: CPU (DD1.29), Keyboard (VD7.2)
NetDD1_30: CPU (DD1.30), Output (R40.1)
NetDD1_32: CPU (DD1.32), Keyboard (VD9.2)
NetDD1_36: CPU (DD1.36), Keyboard (R37.2), Connections (XP2.7)
NetDD1_37: CPU (DD1.37), Keyboard (R36.2), Connections (XP2.8)
NetDD1_39: CPU (DD1.39), Keyboard (R39.2), Connections (XP2.5)
NetDD1_40: CPU (DD1.40), Keyboard (R38.2), Connections (XP2.6)
NetFU7_2: Connections (XP16.1), Output (FU7.2)
NetVD6_1: Keyboard (VD6.1), Connections (XP2.1)
NetVD7_1: Keyboard (VD7.1), Connections (XP2.3)
NetVD8_1: Keyboard (VD8.1), Connections (XP2.2)
NetVD9_1: Keyboard (VD9.1), Connections (XP2.4)
NetVT7_3: Keyboard (VT7.3), Connections (XP2.10)
PISTOL: Connections (XP11.1), Input (J4.1 R27.1 VD4.2)
PISTOL_MCU: CPU (DD1.24), Input (R24.1 VT3.3)
PUMP_L: Connections (XP6.2), Relay (K1.11)
PUMP_RELAY: CPU (DD1.1), Relay (R54.1 R56.1)
SCL: CPU (DD1.15), Connections (FU1.2 R62.1)
SDA: CPU (DD1.16), Connections (FU2.2 R63.1)
VOUT_5_12: Connections (VD14.2 XP17.1), Output (FU6.2)